# EAGLE design halloween (EAGLE 5.10)
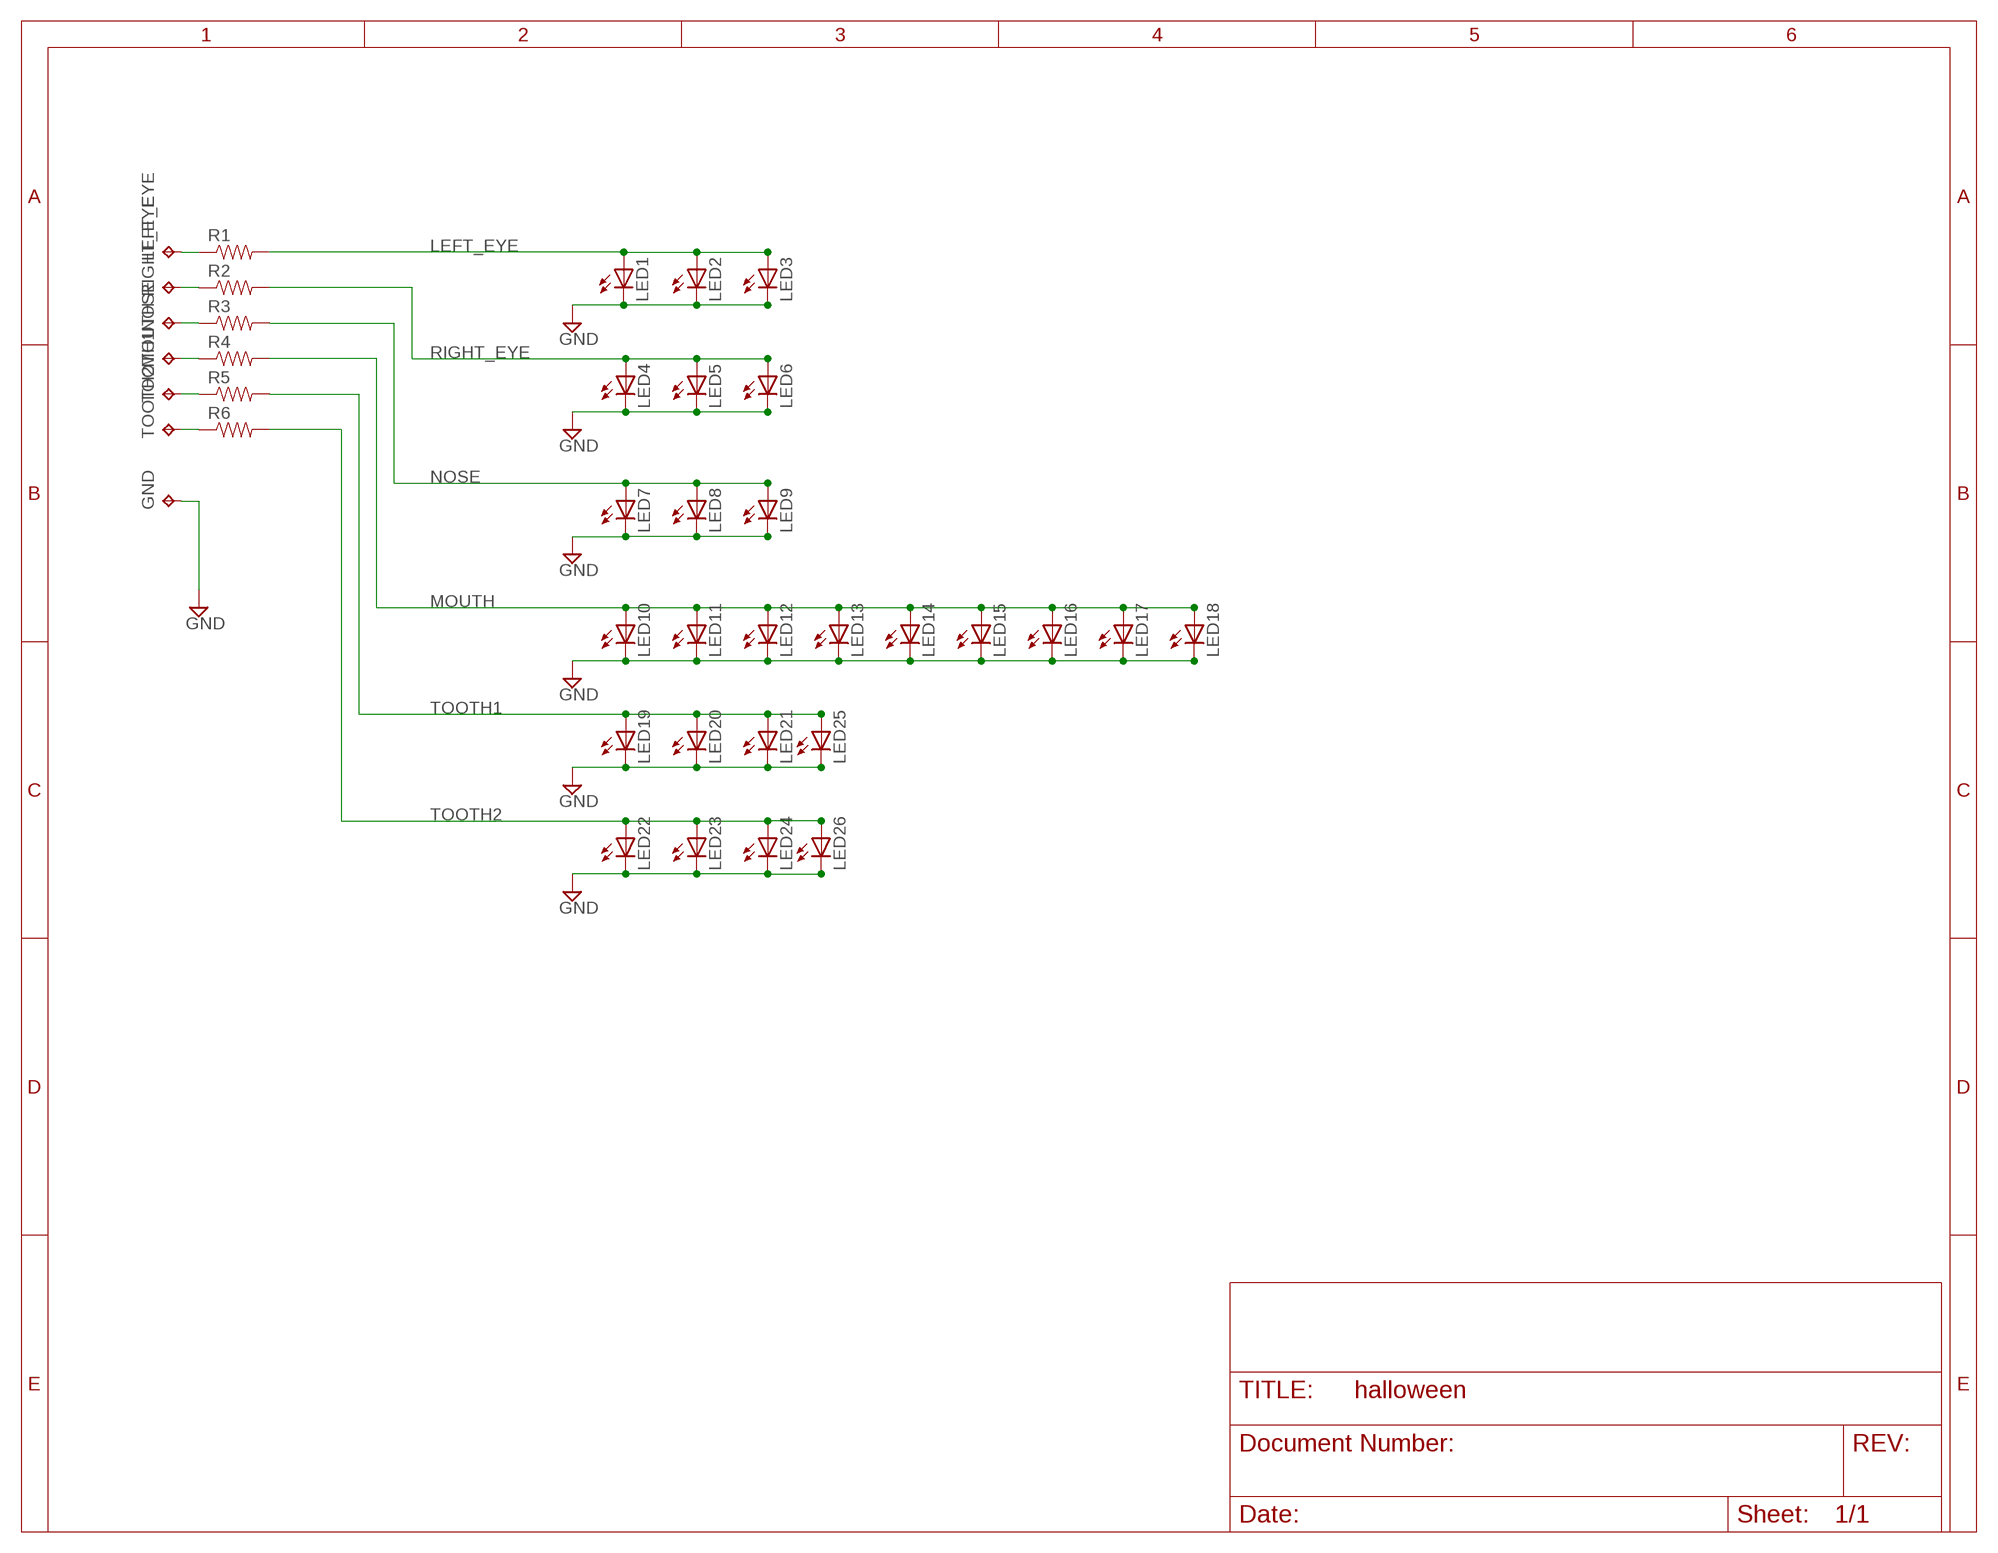
[diagram p0: schematic, sheet 1]

## Parts
GND  TPPAD1-13  [P1-13]
LED1  LED5MM_LARGE_PAD  [LED5MM]
LED2  LED5MM_LARGE_PAD  [LED5MM]
LED3  LED5MM_LARGE_PAD  [LED5MM]
LED4  LED5MM_LARGE_PAD  [LED5MM]
LED5  LED5MM_LARGE_PAD  [LED5MM]
LED6  LED5MM_LARGE_PAD  [LED5MM]
LED7  LED5MM_LARGE_PAD  [LED5MM]
LED8  LED5MM_LARGE_PAD  [LED5MM]
LED9  LED5MM_LARGE_PAD  [LED5MM]
LED10  LED5MM_LARGE_PAD  [LED5MM]
LED11  LED5MM_LARGE_PAD  [LED5MM]
LED12  LED5MM_LARGE_PAD  [LED5MM]
LED13  LED5MM_LARGE_PAD  [LED5MM]
LED14  LED5MM_LARGE_PAD  [LED5MM]
LED15  LED5MM_LARGE_PAD  [LED5MM]
LED16  LED5MM_LARGE_PAD  [LED5MM]
LED17  LED5MM_LARGE_PAD  [LED5MM]
LED18  LED5MM_LARGE_PAD  [LED5MM]
LED19  LED5MM_LARGE_PAD  [LED5MM]
LED20  LED5MM_LARGE_PAD  [LED5MM]
LED21  LED5MM_LARGE_PAD  [LED5MM]
LED22  LED5MM_LARGE_PAD  [LED5MM]
LED23  LED5MM_LARGE_PAD  [LED5MM]
LED24  LED5MM_LARGE_PAD  [LED5MM]
LED25  LED5MM_LARGE_PAD  [LED5MM]
LED26  LED5MM_LARGE_PAD  [LED5MM]
LEFT_EYE  TPPAD1-13  [P1-13]
MOUTH  TPPAD1-13  [P1-13]
NOSE  TPPAD1-13  [P1-13]
R1  RESISTORPTH1  [AXIAL-0.3]
R2  RESISTORPTH1  [AXIAL-0.3]
R3  RESISTORPTH1  [AXIAL-0.3]
R4  RESISTORPTH1  [AXIAL-0.3]
R5  RESISTORPTH1  [AXIAL-0.3]
R6  RESISTORPTH1  [AXIAL-0.3]
RIGHT_EYE  TPPAD1-13  [P1-13]
TOOTH1  TPPAD1-13  [P1-13]
TOOTH2  TPPAD1-13  [P1-13]

## Nets
GND: GND.TP LED1.K(C) LED2.K(C) LED3.K(C) LED4.K(C) LED5.K(C) LED6.K(C) LED7.K(C) LED8.K(C) LED9.K(C) LED10.K(C) LED11.K(C) LED12.K(C) LED13.K(C) LED14.K(C) LED15.K(C) LED16.K(C) LED17.K(C) LED18.K(C) LED19.K(C) LED20.K(C) LED21.K(C) LED22.K(C) LED23.K(C) LED24.K(C) LED25.K(C) LED26.K(C)
LEFT_EYE: LED1.A LED2.A LED3.A R1.P$2
MOUTH: LED10.A LED11.A LED12.A LED13.A LED14.A LED15.A LED16.A LED17.A LED18.A R4.P$2
N$1: LEFT_EYE.TP R1.P$1
N$2: R2.P$1 RIGHT_EYE.TP
N$3: NOSE.TP R3.P$1
N$4: MOUTH.TP R4.P$1
N$5: R5.P$1 TOOTH1.TP
N$6: R6.P$1 TOOTH2.TP
NOSE: LED7.A LED8.A LED9.A R3.P$2
RIGHT_EYE: LED4.A LED5.A LED6.A R2.P$2
TOOTH1: LED19.A LED20.A LED21.A LED25.A R5.P$2
TOOTH2: LED22.A LED23.A LED24.A LED26.A R6.P$2

## Library data of the parts
GND LEFT_EYE MOUTH NOSE RIGHT_EYE TOOTH1 TOOTH2 = testpad:TP: Test pad
LED1-LED26 = led:LED: LED OSRAM: - CHIPLED LG R971, LG N971, LY N971, LG Q971, LY Q971, LO R971, LY R971 LH N974, LH R974 LS Q976, LO Q976, LY Q976 LO Q996 - Hyper CHIPLED LW Q18S LB Q993, LB Q99A, LB R99A - SideLED LS A670, LO A670, LY A670, LG A670, LP A670 LB A673, LV A673, LT A673, LW A673 LH A674 LY A675 LS A676, LA A676, LO A676, LY A676, LW A676 LS A679, LY A679, LG A679 - Hyper Micro SIDELED® LS Y876, LA Y876, LO Y876, LY Y876 LT Y87S - SmartLED LW L88C, LW L88S LB L89C, LB L89S, LG L890 LS L89K, LO L89K, LY L89K LS L896, LA L896, LO L896, LY L896 - TOPLED LS T670, LO T670, LY T670, LG T670, LP T670 LSG T670, LSP T670, LSY T670, LOP T670, LYG T670 LG T671, LOG T671, LSG T671 LB T673, LV T673, LT T673, LW T673 LH T674 LS T676, LA T676, LO T676, LY T676, LB T676, LH T676, LSB T676, LW T676 LB T67C, LV T67C, LT T67C, LS T67K, LO T67K, LY T67K, LW E67C LS E67B, LA E67B, LO E67B, LY E67B, LB E67C, LV E67C, LT E67C LW T67C LS T679, LY T679, LG T679 LS T770, LO T770, LY T770, LG T770, LP T770 LB T773, LV T773, LT T773, LW T773 LH T774 LS E675, LA E675, LY E675, LS T675 LS T776, LA T776, LO T776, LY T776, LB T776 LHGB T686 LT T68C, LB T68C - Hyper Mini TOPLED® LB M676 - Mini TOPLED Santana® LG M470 LS M47K, LO M47K, LY M47K Source: http://www.osram.convergy.de LUXEON: - LUMILED® LXK2-PW12-R00, LXK2-PW12-S00, LXK2-PW14-U00, LXK2-PW14-V00 LXK2-PM12-R00, LXK2-PM12-S00, LXK2-PM14-U00 LXK2-PE12-Q00, LXK2-PE12-R00, LXK2-PE12-S00, LXK2-PE14-T00, LXK2-PE14-U00 LXK2-PB12-K00, LXK2-PB12-L00, LXK2-PB12-M00, LXK2-PB14-N00, LXK2-PB14-P00, LXK2-PB14-Q00 LXK2-PR12-L00, LXK2-PR12-M00, LXK2-PR14-Q00, LXK2-PR14-R00 LXK2-PD12-Q00, LXK2-PD12-R00, LXK2-PD12-S00 LXK2-PH12-R00, LXK2-PH12-S00 LXK2-PL12-P00, LXK2-PL12-Q00, LXK2-PL12-R00 Source: www.luxeon.com KINGBRIGHT: KA-3528ASYC Source: www.kingbright.com
R1-R6 = SparkFun:RESISTOR: Resistor Basic schematic elements and footprints for 0603, 1206, and PTH 1/10th watt (small) resistors.

## Board
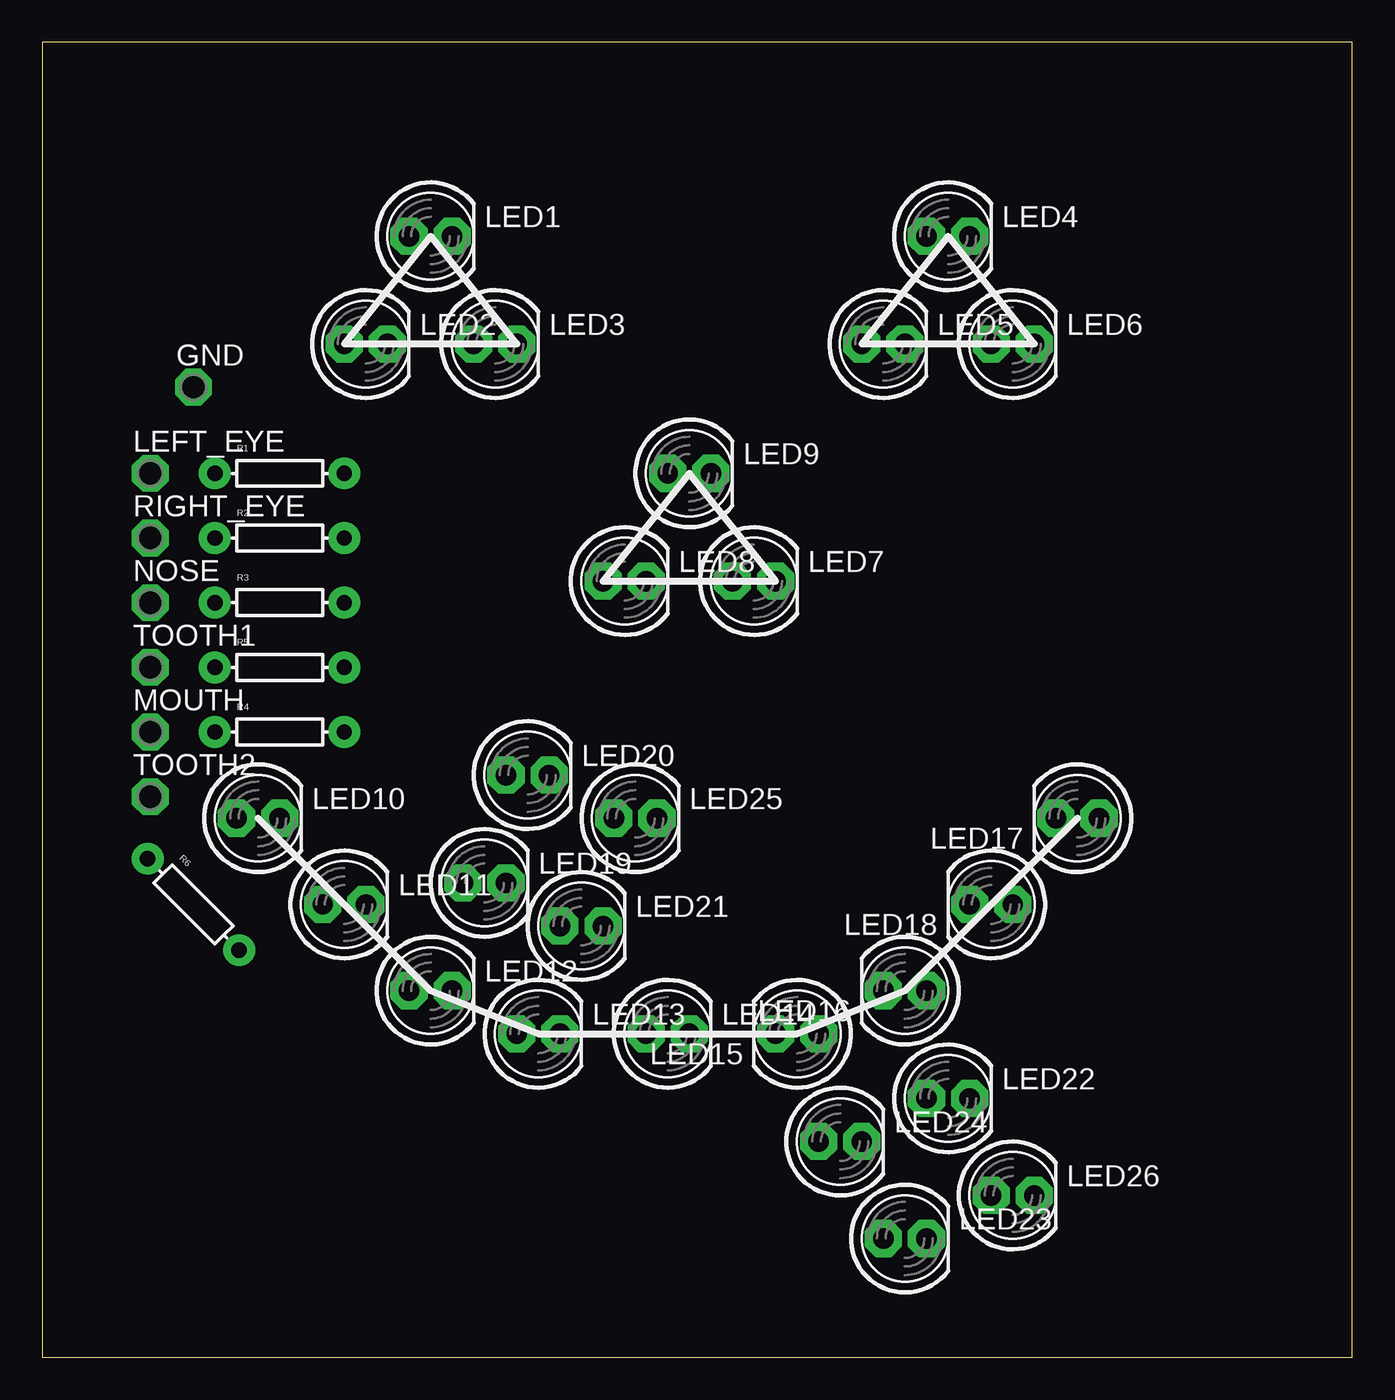
[diagram p1: board, top side]
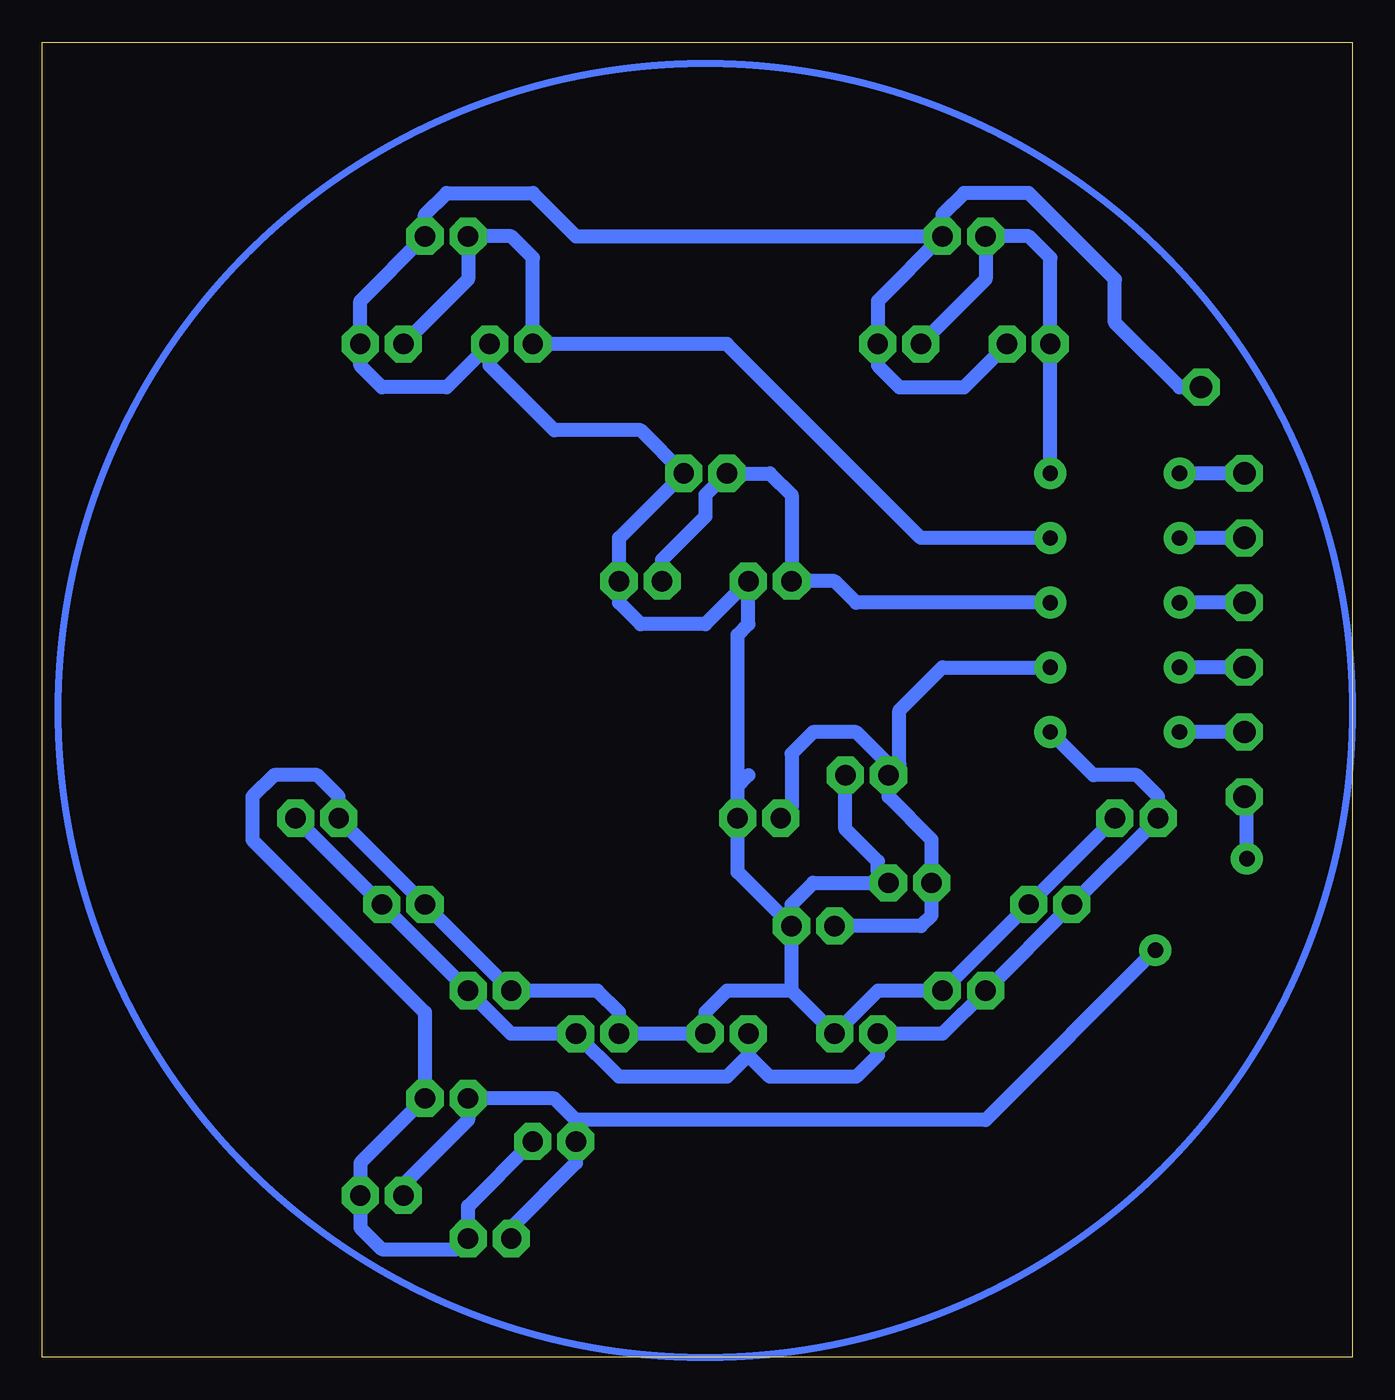
[diagram p2: board, bottom side, seen from below]

Size 77.14 x 77.46 mm. Coordinates in mm from the lower left corner, seen from the top.
Outline: 0,0 77.14,0 77.14,77.46 0,77.46 0,0
Copper layers (1*16): Top 0.035mm / dielectric 1.5mm / Bottom 0.035mm
Design rules "default": minimum track width 10mil, minimum drill 24mil, track to track 8mil, track to pad 8mil, pad to pad 8mil, via to via 8mil, smd to smd 8mil, copper to edge 40mil, drill to drill 8mil, minimum pad ring 10mil, minimum via ring 8mil, stop-mask expansion 4mil, vias tented up to drill 0mil, thermal gap 10mil

### Footprints (pad centres in the part's own frame; a part is rotated, then mirrored left to right if it is on the bottom)
P1-13 = drill 1.321 pad 2.159 octagon: TP 0,0
LED5MM = drill 1.2 pad 2.184 octagon: A -1.27,0; K 1.27,0
AXIAL-0.3 = drill 0.9 pad 1.88 round: P$1 -3.81,0; P$2 3.81,0

### Placement (x,y rotation side)
GND  8.89,57.15 0 top
LED1  22.86,66.04 0 top
LED2  19.05,59.69 0 top
LED3  26.67,59.69 0 top
LED4  53.34,66.04 0 top
LED5  49.53,59.69 0 top
LED6  57.15,59.69 0 top
LED7  41.91,45.72 0 top
LED8  34.29,45.72 0 top
LED9  38.1,52.07 0 top
LED10  12.7,31.75 0 top
LED11  17.78,26.67 0 top
LED12  22.86,21.59 0 top
LED13  29.21,19.05 0 top
LED14  36.83,19.05 0 top
LED15  44.45,19.05 180 top
LED16  50.8,21.59 180 top
LED17  60.96,31.75 180 top
LED18  55.88,26.67 180 top
LED19  26.04,27.94 0 top
LED20  28.57,34.29 0 top
LED21  31.75,25.4 0 top
LED22  53.34,15.24 0 top
LED23  50.8,6.99 0 top
LED24  46.99,12.7 0 top
LED25  34.92,31.75 0 top
LED26  57.15,9.53 0 top
LEFT_EYE  6.35,52.07 0 top
MOUTH  6.35,36.83 0 top
NOSE  6.35,44.45 0 top
R1  13.97,52.07 0 top
R2  13.97,48.26 0 top
R3  13.97,44.45 0 top
R4  13.97,36.83 0 top
R5  13.97,40.64 0 top
R6  8.89,26.67 315 top
RIGHT_EYE  6.35,48.26 0 top
TOOTH1  6.35,40.64 0 top
TOOTH2  6.35,33.02 0 top

### Tracks (layer width: path | path; a pad name or v marks a point on that pad's centre or on a via)
GND
  Bottom 0.813: LED1.K 27.94,62.23 LED3.K 27.94,58.42 26.67,57.15 22.86,57.15 LED2.K | LED10.K LED11.K LED12.K 27.94,21.59 LED13.K 33.02,21.59 | 33.02,21.59 LED21.K | LED21.K 36.2,28.57 LED25.K | LED25.K 36.2,42.55 35.56,43.18 LED8.K 38.1,43.18 41.91,43.18 43.18,44.45 LED7.K 43.18,48.26 LED9.K 41.91,54.61 46.99,54.61 50.8,58.42 LED5.K 53.34,57.15 57.15,57.15 58.42,58.42 LED6.K 58.42,62.23 LED4.K 54.61,67.31 53.34,68.58 48.26,68.58 45.72,66.04 LED1.K | LED25.K 36.2,33.66 35.56,34.29 | 33.02,21.59 36.83,21.59 38.1,20.32 LED14.K LED15.K 43.18,20.32 44.45,21.59 LED16.K LED18.K LED17.K 59.69,33.02 60.96,34.29 63.5,34.29 64.77,33.02 64.77,30.48 54.61,20.32 LED22.K 58.42,11.43 LED26.K 58.42,7.62 57.15,6.35 52.7,6.35 LED23.K 52.07,8.89 LED24.K | LED21.K 33.02,26.67 31.75,27.94 LED19.K 27.94,28.57 27.94,29.21 29.84,31.11 LED20.K | GND.TP 10.16,57.15 13.97,60.96 13.97,63.5 19.05,68.58 22.86,68.58 24.13,67.31 LED1.K
LEFT_EYE
  Bottom 0.813: LED3.A 21.59,63.5 LED1.A 19.05,66.04 17.78,64.77 LED2.A R1.P$2
MOUTH
  Bottom 0.813: R4.P$2 15.24,34.29 12.7,34.29 11.43,33.02 LED10.A LED11.A LED12.A 24.13,19.05 LED13.A 27.94,17.78 29.21,16.51 34.29,16.51 35.56,17.78 | 35.56,17.78 LED14.A | LED17.A LED18.A LED16.A 49.53,19.05 LED15.A 43.18,16.51 36.83,16.51 35.56,17.78
N$1
  Bottom 0.813: LEFT_EYE.TP R1.P$1
N$2
  Bottom 0.813: RIGHT_EYE.TP R2.P$1
N$3
  Bottom 0.813: NOSE.TP R3.P$1
N$4
  Bottom 0.813: MOUTH.TP R4.P$1
N$5
  Bottom 0.813: TOOTH1.TP R5.P$1
N$6
  Bottom 0.813: R6.P$1 6.2,32.87 TOOTH2.TP
NOSE
  Bottom 0.813: R3.P$2 29.21,44.45 30.48,45.72 LED8.A 33.02,50.8 34.29,52.07 LED9.A 38.1,50.8 38.1,49.53 40.64,46.99 LED7.A
RIGHT_EYE
  Bottom 0.813: LED6.A 52.07,63.5 LED4.A 49.53,66.04 48.26,64.77 LED5.A 36.83,59.69 25.4,48.26 R2.P$2
TOOTH1
  Bottom 0.813: R5.P$2 24.13,40.64 26.67,38.1 26.67,34.92 LED20.A | LED20.A 27.3,34.92 29.21,36.83 31.75,36.83 33.02,35.56 33.02,32.38 LED25.A | LED20.A 27.3,33.02 24.77,30.48 LED19.A 24.77,26.04 25.4,25.4 LED21.A
TOOTH2
  Bottom 0.813: LED23.A 49.53,7.62 45.72,11.43 LED24.A 45.72,13.97 | 45.72,13.97 46.99,15.24 LED22.A 52.07,13.97 55.88,10.16 LED26.A | 45.72,13.97 21.59,13.97 R6.P$2
(copper drawn outside any net)
  shapes: Bottom circle x1